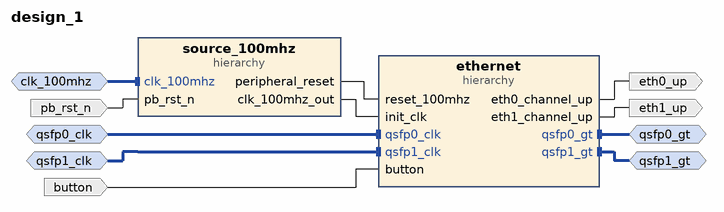
[diagram p0: block diagram of the top level]
# Vivado block design design_1, xczu19eg-ffvc1760-2-i, Vivado 2021.1
create_bd_design design_1

create_bd_intf_port -mode Slave -vlnv xilinx.com:interface:diff_clock_rtl:1.0 clk_100mhz
create_bd_intf_port -mode Slave -vlnv xilinx.com:interface:diff_clock_rtl:1.0 qsfp0_clk
set_property -dict {CONFIG.FREQ_HZ 322265625} [get_bd_intf_ports qsfp0_clk]
create_bd_intf_port -mode Slave -vlnv xilinx.com:interface:diff_clock_rtl:1.0 qsfp1_clk
set_property -dict {CONFIG.FREQ_HZ 322265625} [get_bd_intf_ports qsfp1_clk]
create_bd_intf_port -mode Master -vlnv xilinx.com:interface:gt_rtl:1.0 qsfp0_gt
create_bd_intf_port -mode Master -vlnv xilinx.com:interface:gt_rtl:1.0 qsfp1_gt
create_bd_port -dir I -type rst pb_rst_n
create_bd_port -dir O eth0_up
create_bd_port -dir O eth1_up
create_bd_port -dir I button

create_bd_cell -type hier ethernet
create_bd_cell -type hier source_100mhz

# ---- hierarchy /ethernet ----
current_bd_instance /ethernet
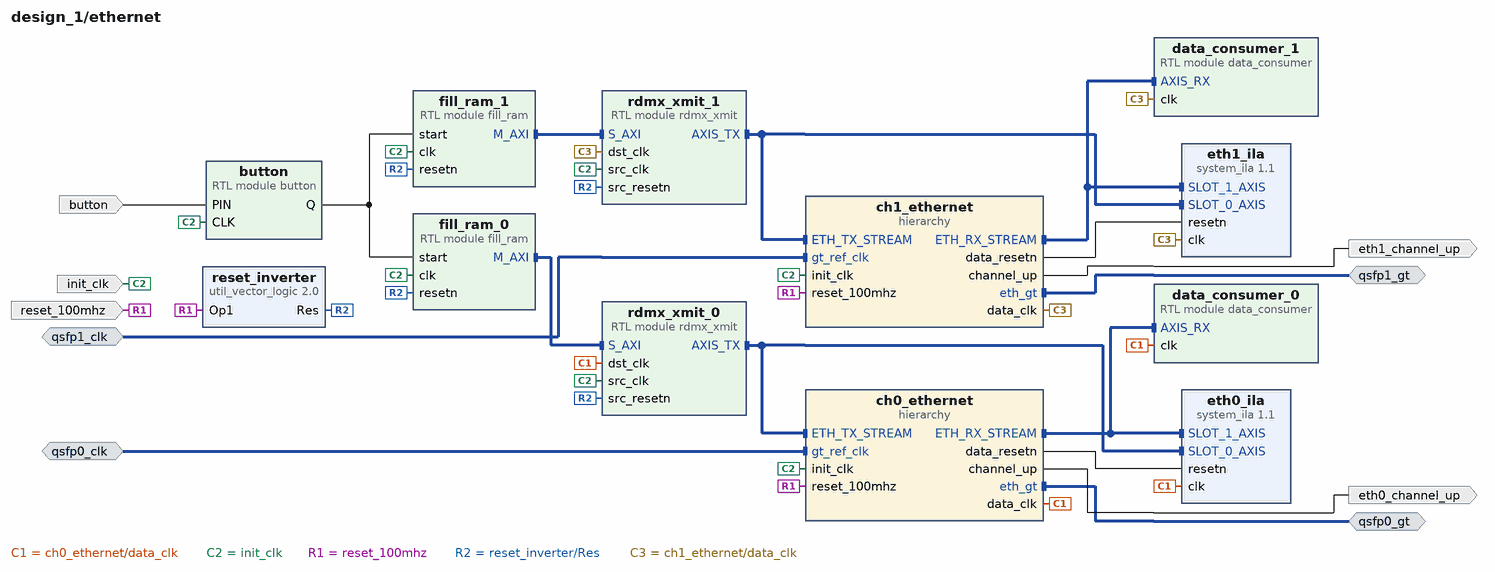
[diagram p1: block diagram inside /ethernet]
create_bd_intf_pin -mode Slave -vlnv xilinx.com:interface:diff_clock_rtl:1.0 qsfp0_clk
create_bd_intf_pin -mode Slave -vlnv xilinx.com:interface:diff_clock_rtl:1.0 qsfp1_clk
create_bd_intf_pin -mode Master -vlnv xilinx.com:interface:gt_rtl:1.0 qsfp0_gt
create_bd_intf_pin -mode Master -vlnv xilinx.com:interface:gt_rtl:1.0 qsfp1_gt
create_bd_pin -dir I -type clk init_clk
create_bd_pin -dir I -type rst reset_100mhz
create_bd_pin -dir O eth0_channel_up
create_bd_pin -dir O eth1_channel_up
create_bd_pin -dir I button

create_bd_cell -type hier ch0_ethernet
create_bd_cell -type hier ch1_ethernet
create_bd_cell -type ip -vlnv xilinx.com:ip:system_ila:1.1 eth0_ila
set_property -dict [list \
  CONFIG.C_DATA_DEPTH 2048 \
  CONFIG.C_MON_TYPE INTERFACE \
  CONFIG.C_NUM_MONITOR_SLOTS 2 \
  CONFIG.C_NUM_OF_PROBES 1 \
  CONFIG.C_PROBE0_TYPE 0 \
  CONFIG.C_PROBE1_TYPE 0 \
  CONFIG.C_SLOT 0 \
  CONFIG.C_SLOT_0_INTF_TYPE xilinx.com:interface:axis_rtl:1.0 \
  CONFIG.C_SLOT_1_INTF_TYPE xilinx.com:interface:axis_rtl:1.0 \
] [get_bd_cells eth0_ila]
create_bd_cell -type ip -vlnv xilinx.com:ip:system_ila:1.1 eth1_ila
set_property -dict [list \
  CONFIG.C_DATA_DEPTH 2048 \
  CONFIG.C_MON_TYPE INTERFACE \
  CONFIG.C_NUM_MONITOR_SLOTS 2 \
  CONFIG.C_NUM_OF_PROBES 1 \
  CONFIG.C_PROBE0_TYPE 0 \
  CONFIG.C_PROBE1_TYPE 0 \
  CONFIG.C_SLOT 1 \
  CONFIG.C_SLOT_0_INTF_TYPE xilinx.com:interface:axis_rtl:1.0 \
  CONFIG.C_SLOT_1_INTF_TYPE xilinx.com:interface:axis_rtl:1.0 \
] [get_bd_cells eth1_ila]
create_bd_cell -type module -reference rdmx_xmit rdmx_xmit_0
set_property -dict {CONFIG.FIFO_CLOCK_MODE independent_clock} [get_bd_cells rdmx_xmit_0]
create_bd_cell -type module -reference data_consumer data_consumer_0
create_bd_cell -type module -reference data_consumer data_consumer_1
create_bd_cell -type module -reference button button
create_bd_cell -type module -reference rdmx_xmit rdmx_xmit_1
set_property -dict {CONFIG.FIFO_CLOCK_MODE independent_clock} [get_bd_cells rdmx_xmit_1]
create_bd_cell -type ip -vlnv xilinx.com:ip:util_vector_logic:2.0 reset_inverter
set_property -dict {CONFIG.C_OPERATION not CONFIG.C_SIZE 1} [get_bd_cells reset_inverter]
create_bd_cell -type module -reference fill_ram fill_ram_0
create_bd_cell -type module -reference fill_ram fill_ram_1
set_property -dict {CONFIG.FIRST_DATA 0x30000000} [get_bd_cells fill_ram_1]

# ---- hierarchy /ethernet/ch0_ethernet ----
current_bd_instance /ethernet/ch0_ethernet
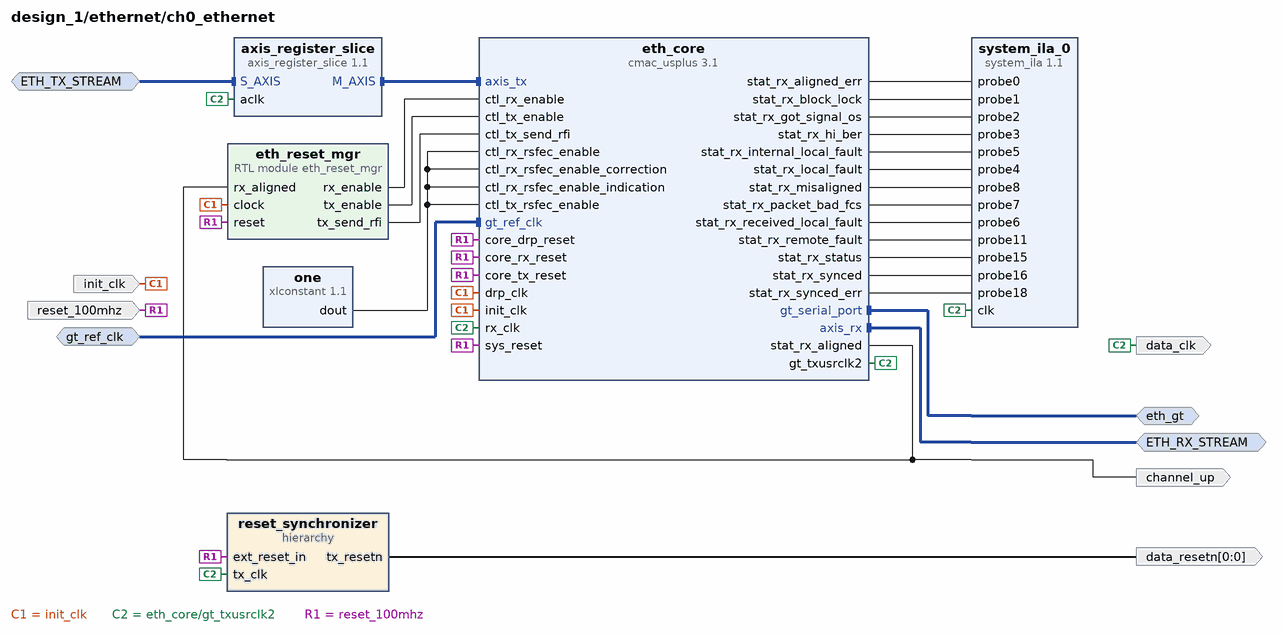
[diagram p2: block diagram inside /ethernet/ch0_ethernet]
create_bd_intf_pin -mode Master -vlnv xilinx.com:interface:gt_rtl:1.0 eth_gt
create_bd_intf_pin -mode Slave -vlnv xilinx.com:interface:diff_clock_rtl:1.0 gt_ref_clk
create_bd_intf_pin -mode Slave -vlnv xilinx.com:interface:axis_rtl:1.0 ETH_TX_STREAM
create_bd_intf_pin -mode Master -vlnv xilinx.com:interface:axis_rtl:1.0 ETH_RX_STREAM
create_bd_pin -dir I -type rst reset_100mhz
create_bd_pin -dir I -type clk init_clk
create_bd_pin -dir O channel_up
create_bd_pin -dir O -from 0 -to 0 data_resetn
create_bd_pin -dir O -type clk data_clk

create_bd_cell -type ip -vlnv xilinx.com:ip:cmac_usplus:3.1 eth_core
set_property -dict [list \
  CONFIG.CMAC_CAUI4_MODE 1 \
  CONFIG.CMAC_CORE_SELECT CMACE4_X0Y1 \
  CONFIG.ENABLE_AXI_INTERFACE 0 \
  CONFIG.GT_GROUP_SELECT {X0Y12~X0Y15} \
  CONFIG.GT_REF_CLK_FREQ 322.265625 \
  CONFIG.INCLUDE_RS_FEC 1 \
  CONFIG.INS_LOSS_NYQ 12 \
  CONFIG.NUM_LANES 4x25 \
  CONFIG.RX_FLOW_CONTROL 0 \
  CONFIG.TX_FLOW_CONTROL 0 \
  CONFIG.USER_INTERFACE AXIS \
] [get_bd_cells eth_core]
create_bd_cell -type hier reset_synchronizer
create_bd_cell -type ip -vlnv xilinx.com:ip:xlconstant:1.1 one
create_bd_cell -type module -reference eth_reset_mgr eth_reset_mgr
create_bd_cell -type ip -vlnv xilinx.com:ip:system_ila:1.1 system_ila_0
set_property -dict {CONFIG.C_MON_TYPE NATIVE CONFIG.C_NUM_OF_PROBES 20} [get_bd_cells system_ila_0]
create_bd_cell -type ip -vlnv xilinx.com:ip:axis_register_slice:1.1 axis_register_slice

# ---- hierarchy /ethernet/ch0_ethernet/reset_synchronizer ----
current_bd_instance /ethernet/ch0_ethernet/reset_synchronizer
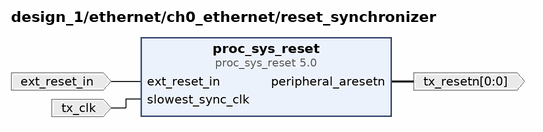
[diagram p3: block diagram inside /ethernet/ch0_ethernet/reset_synchronizer]
create_bd_pin -dir I -type clk tx_clk
create_bd_pin -dir I -type rst ext_reset_in
create_bd_pin -dir O -from 0 -to 0 -type rst tx_resetn

create_bd_cell -type ip -vlnv xilinx.com:ip:proc_sys_reset:5.0 proc_sys_reset

# ---- hierarchy /ethernet/ch1_ethernet ----
current_bd_instance /ethernet/ch1_ethernet
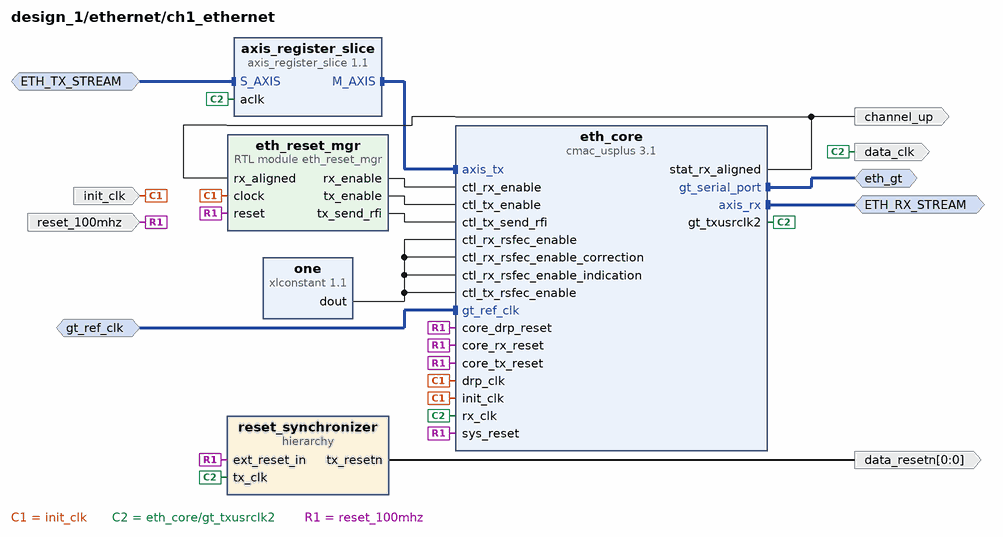
[diagram p4: block diagram inside /ethernet/ch1_ethernet]
create_bd_intf_pin -mode Master -vlnv xilinx.com:interface:gt_rtl:1.0 eth_gt
create_bd_intf_pin -mode Slave -vlnv xilinx.com:interface:diff_clock_rtl:1.0 gt_ref_clk
create_bd_intf_pin -mode Master -vlnv xilinx.com:interface:axis_rtl:1.0 ETH_RX_STREAM
create_bd_intf_pin -mode Slave -vlnv xilinx.com:interface:axis_rtl:1.0 ETH_TX_STREAM
create_bd_pin -dir I -type rst reset_100mhz
create_bd_pin -dir I -type clk init_clk
create_bd_pin -dir O channel_up
create_bd_pin -dir O -type clk data_clk
create_bd_pin -dir O -from 0 -to 0 -type rst data_resetn

create_bd_cell -type ip -vlnv xilinx.com:ip:cmac_usplus:3.1 eth_core
set_property -dict [list \
  CONFIG.CMAC_CAUI4_MODE 1 \
  CONFIG.CMAC_CORE_SELECT CMACE4_X0Y2 \
  CONFIG.ENABLE_AXI_INTERFACE 0 \
  CONFIG.GT_GROUP_SELECT {X0Y16~X0Y19} \
  CONFIG.GT_REF_CLK_FREQ 322.265625 \
  CONFIG.INCLUDE_RS_FEC 1 \
  CONFIG.INS_LOSS_NYQ 12 \
  CONFIG.NUM_LANES 4x25 \
  CONFIG.RX_FLOW_CONTROL 0 \
  CONFIG.TX_FLOW_CONTROL 0 \
  CONFIG.USER_INTERFACE AXIS \
] [get_bd_cells eth_core]
create_bd_cell -type ip -vlnv xilinx.com:ip:xlconstant:1.1 one
create_bd_cell -type module -reference eth_reset_mgr eth_reset_mgr
create_bd_cell -type hier reset_synchronizer
create_bd_cell -type ip -vlnv xilinx.com:ip:axis_register_slice:1.1 axis_register_slice

# ---- hierarchy /ethernet/ch1_ethernet/reset_synchronizer ----
current_bd_instance /ethernet/ch1_ethernet/reset_synchronizer
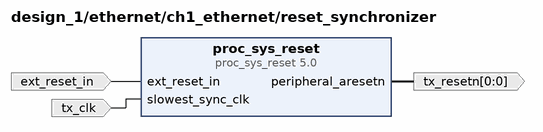
[diagram p5: block diagram inside /ethernet/ch1_ethernet/reset_synchronizer]
create_bd_pin -dir I -type clk tx_clk
create_bd_pin -dir I -type rst ext_reset_in
create_bd_pin -dir O -from 0 -to 0 -type rst tx_resetn

create_bd_cell -type ip -vlnv xilinx.com:ip:proc_sys_reset:5.0 proc_sys_reset

# ---- hierarchy /source_100mhz ----
current_bd_instance /source_100mhz
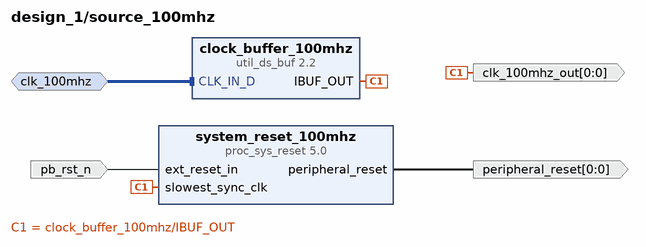
[diagram p6: block diagram inside /source_100mhz]
create_bd_intf_pin -mode Slave -vlnv xilinx.com:interface:diff_clock_rtl:1.0 clk_100mhz
create_bd_pin -dir I -type rst pb_rst_n
create_bd_pin -dir O -from 0 -to 0 -type rst peripheral_reset
create_bd_pin -dir O -from 0 -to 0 -type clk clk_100mhz_out

create_bd_cell -type ip -vlnv xilinx.com:ip:proc_sys_reset:5.0 system_reset_100mhz
create_bd_cell -type ip -vlnv xilinx.com:ip:util_ds_buf:2.2 clock_buffer_100mhz

# ---- connections ----

current_bd_instance /ethernet
connect_bd_intf_net [get_bd_intf_pins qsfp1_gt] [get_bd_intf_pins ch1_ethernet/eth_gt]
connect_bd_intf_net [get_bd_intf_pins qsfp0_gt] [get_bd_intf_pins ch0_ethernet/eth_gt]
connect_bd_intf_net [get_bd_intf_pins data_consumer_0/AXIS_RX] [get_bd_intf_pins ch0_ethernet/ETH_RX_STREAM]
connect_bd_intf_net [get_bd_intf_pins data_consumer_0/AXIS_RX] [get_bd_intf_pins eth0_ila/SLOT_1_AXIS]
connect_bd_intf_net [get_bd_intf_pins data_consumer_1/AXIS_RX] [get_bd_intf_pins ch1_ethernet/ETH_RX_STREAM]
connect_bd_intf_net [get_bd_intf_pins data_consumer_1/AXIS_RX] [get_bd_intf_pins eth1_ila/SLOT_1_AXIS]
connect_bd_intf_net [get_bd_intf_pins fill_ram_0/M_AXI] [get_bd_intf_pins rdmx_xmit_0/S_AXI]
connect_bd_intf_net [get_bd_intf_pins fill_ram_1/M_AXI] [get_bd_intf_pins rdmx_xmit_1/S_AXI]
connect_bd_intf_net [get_bd_intf_pins qsfp0_clk] [get_bd_intf_pins ch0_ethernet/gt_ref_clk]
connect_bd_intf_net [get_bd_intf_pins qsfp1_clk] [get_bd_intf_pins ch1_ethernet/gt_ref_clk]
connect_bd_intf_net [get_bd_intf_pins rdmx_xmit_0/AXIS_TX] [get_bd_intf_pins ch0_ethernet/ETH_TX_STREAM]
connect_bd_intf_net [get_bd_intf_pins rdmx_xmit_0/AXIS_TX] [get_bd_intf_pins eth0_ila/SLOT_0_AXIS]
connect_bd_intf_net [get_bd_intf_pins rdmx_xmit_1/AXIS_TX] [get_bd_intf_pins ch1_ethernet/ETH_TX_STREAM]
connect_bd_intf_net [get_bd_intf_pins rdmx_xmit_1/AXIS_TX] [get_bd_intf_pins eth1_ila/SLOT_0_AXIS]
connect_bd_net -net button_1_Q [get_bd_pins button/Q] [get_bd_pins fill_ram_0/start] [get_bd_pins fill_ram_1/start]
connect_bd_net [get_bd_pins button] [get_bd_pins button/PIN]
connect_bd_net -net ch0_ethernet_gt_txusrclk2 [get_bd_pins ch0_ethernet/data_clk] \
  [get_bd_pins eth0_ila/clk] [get_bd_pins rdmx_xmit_0/dst_clk] [get_bd_pins data_consumer_0/clk]
connect_bd_net -net ch0_ethernet_rx_resetn [get_bd_pins ch0_ethernet/data_resetn] [get_bd_pins eth0_ila/resetn]
connect_bd_net -net ch1_ethernet_tx_resetn [get_bd_pins ch1_ethernet/data_resetn] [get_bd_pins eth1_ila/resetn]
connect_bd_net -net clock_1 [get_bd_pins init_clk] \
  [get_bd_pins ch0_ethernet/init_clk] [get_bd_pins ch1_ethernet/init_clk] [get_bd_pins button/CLK] \
  [get_bd_pins rdmx_xmit_1/src_clk] [get_bd_pins rdmx_xmit_0/src_clk] [get_bd_pins fill_ram_0/clk] \
  [get_bd_pins fill_ram_1/clk]
connect_bd_net -net eth0_channel_up [get_bd_pins ch0_ethernet/channel_up] [get_bd_pins eth0_channel_up]
connect_bd_net -net eth1_channel_up [get_bd_pins ch1_ethernet/channel_up] [get_bd_pins eth1_channel_up]
connect_bd_net -net reset_in_1 [get_bd_pins reset_100mhz] \
  [get_bd_pins ch0_ethernet/reset_100mhz] [get_bd_pins ch1_ethernet/reset_100mhz] [get_bd_pins reset_inverter/Op1]
connect_bd_net [get_bd_pins reset_inverter/Res] \
  [get_bd_pins rdmx_xmit_0/src_resetn] [get_bd_pins rdmx_xmit_1/src_resetn] [get_bd_pins fill_ram_0/resetn] \
  [get_bd_pins fill_ram_1/resetn]
connect_bd_net -net tx_clk_1 [get_bd_pins ch1_ethernet/data_clk] \
  [get_bd_pins eth1_ila/clk] [get_bd_pins data_consumer_1/clk] [get_bd_pins rdmx_xmit_1/dst_clk]

current_bd_instance /ethernet/ch0_ethernet
connect_bd_intf_net [get_bd_intf_pins eth_gt] [get_bd_intf_pins eth_core/gt_serial_port]
connect_bd_intf_net [get_bd_intf_pins ETH_TX_STREAM] [get_bd_intf_pins axis_register_slice/S_AXIS]
connect_bd_intf_net [get_bd_intf_pins axis_register_slice/M_AXIS] [get_bd_intf_pins eth_core/axis_tx]
connect_bd_intf_net [get_bd_intf_pins ETH_RX_STREAM] [get_bd_intf_pins eth_core/axis_rx]
connect_bd_intf_net [get_bd_intf_pins gt_ref_clk] [get_bd_intf_pins eth_core/gt_ref_clk]
connect_bd_net -net clock_1 [get_bd_pins init_clk] [get_bd_pins eth_core/drp_clk] [get_bd_pins eth_core/init_clk] [get_bd_pins eth_reset_mgr/clock]
connect_bd_net [get_bd_pins eth_core/gt_txusrclk2] \
  [get_bd_pins data_clk] [get_bd_pins eth_core/rx_clk] [get_bd_pins reset_synchronizer/tx_clk] [get_bd_pins system_ila_0/clk] \
  [get_bd_pins axis_register_slice/aclk]
connect_bd_net [get_bd_pins eth_core/stat_rx_aligned] [get_bd_pins eth_reset_mgr/rx_aligned] [get_bd_pins channel_up]
connect_bd_net [get_bd_pins eth_core/stat_rx_aligned_err] [get_bd_pins system_ila_0/probe0]
connect_bd_net [get_bd_pins eth_core/stat_rx_block_lock] [get_bd_pins system_ila_0/probe1]
connect_bd_net [get_bd_pins eth_core/stat_rx_got_signal_os] [get_bd_pins system_ila_0/probe2]
connect_bd_net [get_bd_pins eth_core/stat_rx_hi_ber] [get_bd_pins system_ila_0/probe3]
connect_bd_net [get_bd_pins eth_core/stat_rx_internal_local_fault] [get_bd_pins system_ila_0/probe5]
connect_bd_net [get_bd_pins eth_core/stat_rx_local_fault] [get_bd_pins system_ila_0/probe4]
connect_bd_net [get_bd_pins eth_core/stat_rx_misaligned] [get_bd_pins system_ila_0/probe8]
connect_bd_net [get_bd_pins eth_core/stat_rx_packet_bad_fcs] [get_bd_pins system_ila_0/probe7]
connect_bd_net [get_bd_pins eth_core/stat_rx_received_local_fault] [get_bd_pins system_ila_0/probe6]
connect_bd_net [get_bd_pins eth_core/stat_rx_remote_fault] [get_bd_pins system_ila_0/probe11]
connect_bd_net [get_bd_pins eth_core/stat_rx_status] [get_bd_pins system_ila_0/probe15]
connect_bd_net [get_bd_pins eth_core/stat_rx_synced] [get_bd_pins system_ila_0/probe16]
connect_bd_net [get_bd_pins eth_core/stat_rx_synced_err] [get_bd_pins system_ila_0/probe18]
connect_bd_net -net eth_reset_mgr_0_rx_enable [get_bd_pins eth_reset_mgr/rx_enable] [get_bd_pins eth_core/ctl_rx_enable]
connect_bd_net -net eth_reset_mgr_0_tx_enable [get_bd_pins eth_reset_mgr/tx_enable] [get_bd_pins eth_core/ctl_tx_enable]
connect_bd_net -net eth_reset_mgr_0_tx_send_rfi [get_bd_pins eth_reset_mgr/tx_send_rfi] [get_bd_pins eth_core/ctl_tx_send_rfi]
connect_bd_net [get_bd_pins one/dout] \
  [get_bd_pins eth_core/ctl_rx_rsfec_enable] [get_bd_pins eth_core/ctl_tx_rsfec_enable] \
  [get_bd_pins eth_core/ctl_rx_rsfec_enable_correction] [get_bd_pins eth_core/ctl_rx_rsfec_enable_indication]
connect_bd_net -net proc_sys_reset_0_interconnect_aresetn [get_bd_pins reset_synchronizer/tx_resetn] [get_bd_pins data_resetn]
connect_bd_net -net reset_in_1 [get_bd_pins reset_100mhz] \
  [get_bd_pins eth_core/core_tx_reset] [get_bd_pins eth_core/core_rx_reset] [get_bd_pins eth_core/core_drp_reset] \
  [get_bd_pins eth_core/sys_reset] [get_bd_pins reset_synchronizer/ext_reset_in] [get_bd_pins eth_reset_mgr/reset]

current_bd_instance /ethernet/ch0_ethernet/reset_synchronizer
connect_bd_net -net ethernet_usr_rx_reset [get_bd_pins ext_reset_in] [get_bd_pins proc_sys_reset/ext_reset_in]
connect_bd_net [get_bd_pins proc_sys_reset/peripheral_aresetn] [get_bd_pins tx_resetn]
connect_bd_net -net qsfp0_ethernet_gt_rxusrclk2 [get_bd_pins tx_clk] [get_bd_pins proc_sys_reset/slowest_sync_clk]

current_bd_instance /ethernet/ch1_ethernet
connect_bd_intf_net [get_bd_intf_pins eth_gt] [get_bd_intf_pins eth_core/gt_serial_port]
connect_bd_intf_net [get_bd_intf_pins ETH_TX_STREAM] [get_bd_intf_pins axis_register_slice/S_AXIS]
connect_bd_intf_net [get_bd_intf_pins axis_register_slice/M_AXIS] [get_bd_intf_pins eth_core/axis_tx]
connect_bd_intf_net [get_bd_intf_pins ETH_RX_STREAM] [get_bd_intf_pins eth_core/axis_rx]
connect_bd_intf_net [get_bd_intf_pins gt_ref_clk] [get_bd_intf_pins eth_core/gt_ref_clk]
connect_bd_net -net clock_1 [get_bd_pins init_clk] [get_bd_pins eth_core/drp_clk] [get_bd_pins eth_core/init_clk] [get_bd_pins eth_reset_mgr/clock]
connect_bd_net [get_bd_pins eth_core/gt_txusrclk2] \
  [get_bd_pins data_clk] [get_bd_pins eth_core/rx_clk] [get_bd_pins reset_synchronizer/tx_clk] \
  [get_bd_pins axis_register_slice/aclk]
connect_bd_net [get_bd_pins eth_core/stat_rx_aligned] [get_bd_pins eth_reset_mgr/rx_aligned] [get_bd_pins channel_up]
connect_bd_net -net eth_reset_mgr_0_rx_enable [get_bd_pins eth_reset_mgr/rx_enable] [get_bd_pins eth_core/ctl_rx_enable]
connect_bd_net -net eth_reset_mgr_0_tx_enable [get_bd_pins eth_reset_mgr/tx_enable] [get_bd_pins eth_core/ctl_tx_enable]
connect_bd_net -net eth_reset_mgr_0_tx_send_rfi [get_bd_pins eth_reset_mgr/tx_send_rfi] [get_bd_pins eth_core/ctl_tx_send_rfi]
connect_bd_net [get_bd_pins one/dout] \
  [get_bd_pins eth_core/ctl_rx_rsfec_enable] [get_bd_pins eth_core/ctl_tx_rsfec_enable] \
  [get_bd_pins eth_core/ctl_rx_rsfec_enable_correction] [get_bd_pins eth_core/ctl_rx_rsfec_enable_indication]
connect_bd_net -net reset_in_1 [get_bd_pins reset_100mhz] \
  [get_bd_pins eth_core/core_rx_reset] [get_bd_pins eth_core/core_tx_reset] [get_bd_pins eth_core/core_drp_reset] \
  [get_bd_pins eth_core/sys_reset] [get_bd_pins eth_reset_mgr/reset] [get_bd_pins reset_synchronizer/ext_reset_in]
connect_bd_net [get_bd_pins reset_synchronizer/tx_resetn] [get_bd_pins data_resetn]

current_bd_instance /ethernet/ch1_ethernet/reset_synchronizer
connect_bd_net -net ethernet_usr_rx_reset [get_bd_pins ext_reset_in] [get_bd_pins proc_sys_reset/ext_reset_in]
connect_bd_net [get_bd_pins proc_sys_reset/peripheral_aresetn] [get_bd_pins tx_resetn]
connect_bd_net -net qsfp0_ethernet_gt_rxusrclk2 [get_bd_pins tx_clk] [get_bd_pins proc_sys_reset/slowest_sync_clk]

current_bd_instance /source_100mhz
connect_bd_intf_net [get_bd_intf_pins clk_100mhz] [get_bd_intf_pins clock_buffer_100mhz/CLK_IN_D]
connect_bd_net [get_bd_pins clock_buffer_100mhz/IBUF_OUT] [get_bd_pins system_reset_100mhz/slowest_sync_clk] [get_bd_pins clk_100mhz_out]
connect_bd_net [get_bd_pins pb_rst_n] [get_bd_pins system_reset_100mhz/ext_reset_in]
connect_bd_net [get_bd_pins system_reset_100mhz/peripheral_reset] [get_bd_pins peripheral_reset]

current_bd_instance /
connect_bd_intf_net [get_bd_intf_ports qsfp0_clk] [get_bd_intf_pins ethernet/qsfp0_clk]
connect_bd_intf_net [get_bd_intf_ports qsfp1_clk] [get_bd_intf_pins ethernet/qsfp1_clk]
connect_bd_intf_net [get_bd_intf_ports clk_100mhz] [get_bd_intf_pins source_100mhz/clk_100mhz]
connect_bd_intf_net [get_bd_intf_ports qsfp0_gt] [get_bd_intf_pins ethernet/qsfp0_gt]
connect_bd_intf_net [get_bd_intf_ports qsfp1_gt] [get_bd_intf_pins ethernet/qsfp1_gt]
connect_bd_net -net PIN_0_1 [get_bd_ports button] [get_bd_pins ethernet/button]
connect_bd_net -net eth0_channel_up [get_bd_pins ethernet/eth0_channel_up] [get_bd_ports eth0_up]
connect_bd_net -net eth1_channel_up [get_bd_pins ethernet/eth1_channel_up] [get_bd_ports eth1_up]
connect_bd_net [get_bd_ports pb_rst_n] [get_bd_pins source_100mhz/pb_rst_n]
connect_bd_net -net reset_100mhz_1 [get_bd_pins source_100mhz/peripheral_reset] [get_bd_pins ethernet/reset_100mhz]
connect_bd_net -net util_ds_buf_0_IBUF_OUT [get_bd_pins source_100mhz/clk_100mhz_out] [get_bd_pins ethernet/init_clk]

# ---- address map ----
assign_bd_address -offset 0x00000 -range 1M -target_address_space [get_bd_addr_spaces ethernet/fill_ram_0/M_AXI] [get_bd_addr_segs ethernet/rdmx_xmit_0/S_AXI/reg0]
assign_bd_address -offset 0x00000 -range 1M -target_address_space [get_bd_addr_spaces ethernet/fill_ram_1/M_AXI] [get_bd_addr_segs ethernet/rdmx_xmit_1/S_AXI/reg0]

validate_bd_design
save_bd_design
